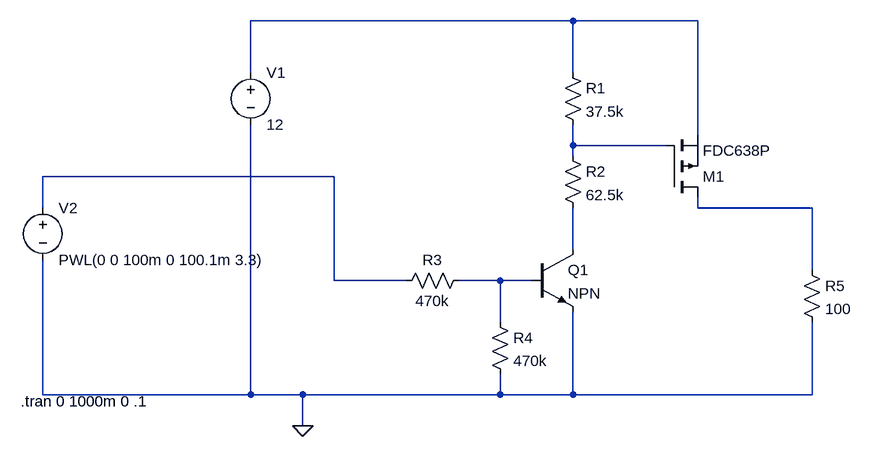
[diagram p0: schematic HighSideDriver.asc]
HighSideDriver.asc, the LTspice schematic file:
Version 4
SHEET 1 1060 680
WIRE 96 0 -400 0
WIRE 288 0 96 0
WIRE -400 80 -400 0
WIRE 96 80 96 0
WIRE 288 176 288 0
WIRE 96 192 96 160
WIRE 240 192 96 192
WIRE 96 208 96 192
WIRE -272 240 -720 240
WIRE -720 288 -720 240
WIRE 288 288 288 272
WIRE 464 288 288 288
WIRE 96 352 96 288
WIRE 464 384 464 288
WIRE -272 400 -272 240
WIRE -160 400 -272 400
WIRE -16 400 -80 400
WIRE 32 400 -16 400
WIRE -16 464 -16 400
WIRE -720 576 -720 368
WIRE -400 576 -400 160
WIRE -400 576 -720 576
WIRE -320 576 -400 576
WIRE -16 576 -16 544
WIRE -16 576 -320 576
WIRE 96 576 96 448
WIRE 96 576 -16 576
WIRE 464 576 464 464
WIRE 464 576 96 576
WIRE -320 624 -320 576
FLAG -320 624 0
SYMBOL pmos 240 272 M180
SYMATTR InstName M1
SYMATTR Value FDC638P
SYMBOL npn 32 352 R0
SYMATTR InstName Q1
SYMBOL voltage -400 64 R0
WINDOW 123 0 0 Left 2
WINDOW 39 0 0 Left 2
SYMATTR InstName V1
SYMATTR Value 12
SYMBOL res 80 64 R0
SYMATTR InstName R1
SYMATTR Value 37.5k
SYMATTR SpiceLine tol=5 pwr=.1
SYMBOL res 80 192 R0
SYMATTR InstName R2
SYMATTR Value 62.5k
SYMATTR SpiceLine tol=5 pwr=.1
SYMBOL res -64 384 R90
WINDOW 0 0 56 VBottom 2
WINDOW 3 32 56 VTop 2
SYMATTR InstName R3
SYMATTR Value 470k
SYMATTR SpiceLine tol=5 pwr=.1
SYMBOL res -32 448 R0
SYMATTR InstName R4
SYMATTR Value 470k
SYMATTR SpiceLine tol=5 pwr=.1
SYMBOL voltage -720 272 R0
WINDOW 123 0 0 Left 2
WINDOW 39 0 0 Left 2
SYMATTR InstName V2
SYMATTR Value PWL(0 0 100m 0 100.1m 3.3)
SYMBOL res 448 368 R0
SYMATTR InstName R5
SYMATTR Value 100
TEXT -754 586 Left 2 !.tran 0 1000m 0 .1

The netlist it stands for:
* HighSideDriver.asc
M1 N004 N002 N001 N001 FDC638P
Q1 N005 N006 0 0 NPN
V1 N001 0 12
R1 N001 N002 37.5k tol=5 pwr=.1
R2 N002 N005 62.5k tol=5 pwr=.1
R3 N006 N003 470k tol=5 pwr=.1
R4 N006 0 470k tol=5 pwr=.1
V2 N003 0 PWL(0 0 100m 0 100.1m 3.3)
R5 N004 0 100
.model NPN NPN
.model PNP PNP
.lib standard.bjt
.model NMOS NMOS
.model PMOS PMOS
.lib standard.mos
.tran 0 1000m 0 .1
.backanno
.end